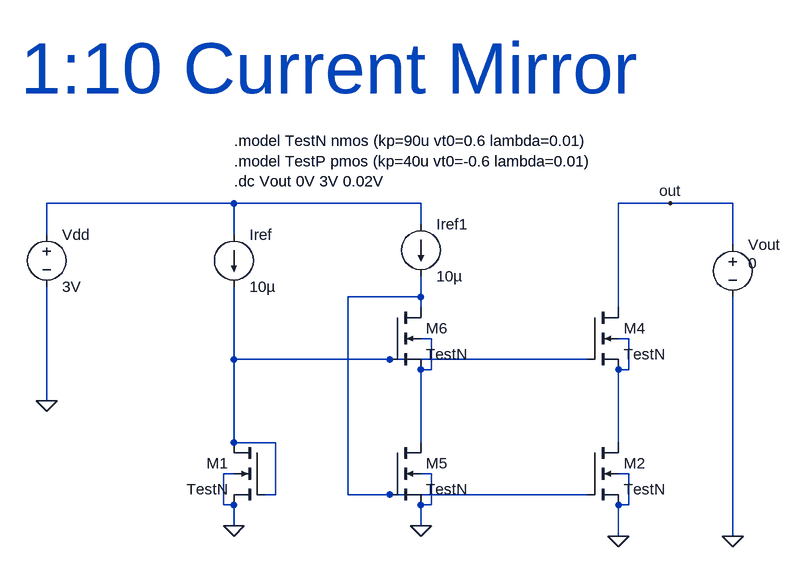
[diagram p0: schematic wide_swing.asc]
wide_swing.asc, the LTspice schematic file:
Version 4
SHEET 1 880 1464
WIRE -688 896 -976 896
WIRE -400 896 -688 896
WIRE -16 896 -96 896
WIRE 80 896 -16 896
WIRE -400 928 -400 896
WIRE -976 944 -976 896
WIRE -688 944 -688 896
WIRE 80 960 80 896
WIRE -400 1040 -400 1008
WIRE -400 1040 -512 1040
WIRE -400 1056 -400 1040
WIRE -96 1056 -96 896
WIRE -384 1104 -400 1104
WIRE -80 1104 -96 1104
WIRE -688 1136 -688 1024
WIRE -448 1136 -688 1136
WIRE -144 1136 -448 1136
WIRE -384 1152 -384 1104
WIRE -384 1152 -400 1152
WIRE -80 1152 -80 1104
WIRE -80 1152 -96 1152
WIRE -976 1200 -976 1024
WIRE -688 1264 -688 1136
WIRE -624 1264 -688 1264
WIRE -400 1264 -400 1152
WIRE -96 1264 -96 1152
WIRE -688 1312 -704 1312
WIRE -384 1312 -400 1312
WIRE -80 1312 -96 1312
WIRE -624 1344 -624 1264
WIRE -624 1344 -640 1344
WIRE -512 1344 -512 1040
WIRE -448 1344 -512 1344
WIRE -144 1344 -448 1344
WIRE -704 1360 -704 1312
WIRE -688 1360 -704 1360
WIRE -384 1360 -384 1312
WIRE -384 1360 -400 1360
WIRE -80 1360 -80 1312
WIRE -80 1360 -96 1360
WIRE -688 1392 -688 1360
WIRE -400 1392 -400 1360
WIRE -96 1408 -96 1360
WIRE 80 1408 80 1040
FLAG -688 1392 0
FLAG -976 1200 0
FLAG -96 1408 0
FLAG 80 1408 0
FLAG -16 896 out
FLAG -400 1392 0
SYMBOL voltage 80 944 R0
WINDOW 3 24 44 Left 2
WINDOW 123 0 0 Left 2
WINDOW 39 0 0 Left 2
SYMATTR Value 0
SYMATTR InstName Vout
SYMBOL current -688 944 R0
WINDOW 123 0 0 Left 2
WINDOW 39 0 0 Left 2
SYMATTR InstName Iref
SYMATTR Value 10µ
SYMBOL voltage -976 928 R0
SYMATTR InstName Vdd
SYMATTR Value 3V
SYMBOL nmos4 -640 1264 M0
SYMATTR InstName M1
SYMATTR Value TestN
SYMATTR Value2 l=10u w=25u
SYMBOL nmos4 -144 1264 R0
SYMATTR InstName M2
SYMATTR Value TestN
SYMATTR Value2 l=10u w=1000u
SYMBOL nmos4 -144 1056 R0
SYMATTR InstName M4
SYMATTR Value TestN
SYMATTR Value2 l=10u w=1000u
SYMBOL nmos4 -448 1056 R0
SYMATTR InstName M6
SYMATTR Value TestN
SYMATTR Value2 l=10u w=100u
SYMBOL nmos4 -448 1264 R0
SYMATTR InstName M5
SYMATTR Value TestN
SYMATTR Value2 l=10u w=100u
SYMBOL current -400 928 R0
WINDOW 123 0 0 Left 2
WINDOW 39 0 0 Left 2
SYMATTR InstName Iref1
SYMATTR Value 10µ
TEXT -688 800 Left 2 !.model TestN nmos (kp=90u vt0=0.6 lambda=0.01)\n.model TestP pmos (kp=40u vt0=-0.6 lambda=0.01)\n.dc Vout 0V 3V 0.02V
TEXT -1016 688 Left 7 ;1:10 Current Mirror

The netlist it stands for:
* wide_swing.asc
Vout out 0 0
Iref N001 N005 10µ
Vdd N001 0 3V
M1 N005 N005 0 0 TestN l=10u w=25u
M2 N004 N002 0 0 TestN l=10u w=1000u
M4 out N005 N004 N004 TestN l=10u w=1000u
M6 N002 N005 N003 N003 TestN l=10u w=100u
M5 N003 N002 0 0 TestN l=10u w=100u
Iref1 N001 N002 10µ
.model NMOS NMOS
.model PMOS PMOS
.lib standard.mos
.model TestN nmos (kp=90u vt0=0.6 lambda=0.01)
.model TestP pmos (kp=40u vt0=-0.6 lambda=0.01)
.dc Vout 0V 3V 0.02V
* 1:10 Current Mirror
.backanno
.end